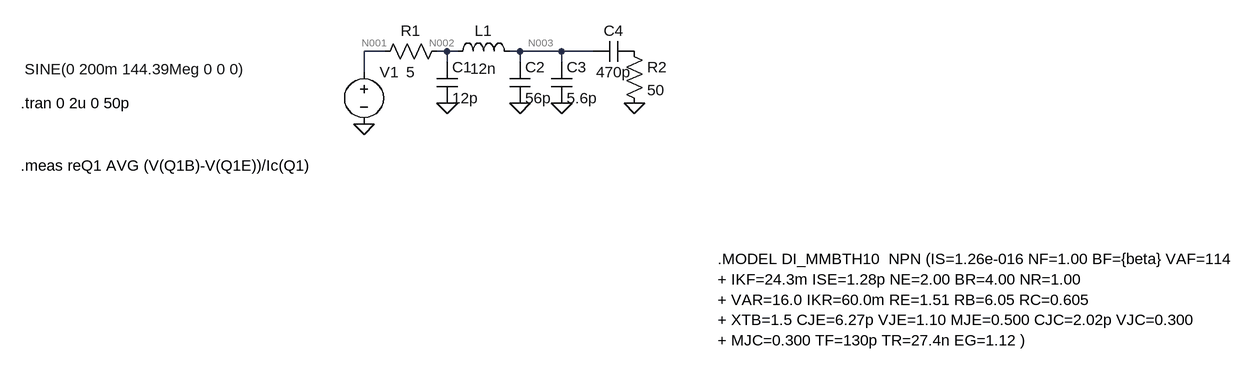
[diagram p0: schematic Draft2.asc]
Draft2.asc, the LTspice schematic file:
Version 4
SHEET 1 1380 680
WIRE -256 96 -288 96
WIRE -160 96 -176 96
WIRE -144 96 -160 96
WIRE -48 96 -64 96
WIRE 16 96 -48 96
WIRE 64 96 16 96
WIRE -160 112 -160 96
WIRE -48 112 -48 96
WIRE 16 112 16 96
WIRE -288 128 -288 96
FLAG -288 208 0
FLAG 16 176 0
FLAG -48 176 0
FLAG -160 176 0
FLAG 128 176 0
SYMBOL voltage -288 112 R0
WINDOW 3 -522 11 Left 2
WINDOW 123 0 0 Left 0
WINDOW 39 0 0 Left 0
SYMATTR Value SINE(0 200m 144.39Meg 0 0 0)
SYMATTR InstName V1
SYMBOL res -160 80 R90
WINDOW 0 0 56 VBottom 2
WINDOW 3 32 56 VTop 2
SYMATTR InstName R1
SYMATTR Value 5
SYMBOL ind -160 112 R270
WINDOW 0 32 56 VTop 2
WINDOW 3 5 56 VBottom 2
SYMATTR InstName L1
SYMATTR Value 12n
SYMBOL cap -176 112 R0
SYMATTR InstName C1
SYMATTR Value 12p
SYMBOL cap -64 112 R0
SYMATTR InstName C2
SYMATTR Value 56p
SYMBOL cap 0 112 R0
SYMATTR InstName C3
SYMATTR Value 5.6p
SYMBOL cap 128 80 R90
WINDOW 0 0 32 VBottom 2
WINDOW 3 32 32 VTop 2
SYMATTR InstName C4
SYMATTR Value 470p
SYMBOL res 112 80 R0
SYMATTR InstName R2
SYMATTR Value 50
TEXT 256 416 Left 2 !.MODEL DI_MMBTH10  NPN (IS=1.26e-016 NF=1.00 BF={beta} VAF=114\n+ IKF=24.3m ISE=1.28p NE=2.00 BR=4.00 NR=1.00\n+ VAR=16.0 IKR=60.0m RE=1.51 RB=6.05 RC=0.605\n+ XTB=1.5 CJE=6.27p VJE=1.10 MJE=0.500 CJC=2.02p VJC=0.300\n+ MJC=0.300 TF=130p TR=27.4n EG=1.12 )
TEXT -816 176 Left 2 !.tran 0 2u 0 50p
TEXT -816 272 Left 2 !.meas reQ1 AVG (V(Q1B)-V(Q1E))/Ic(Q1)

The netlist it stands for:
* Draft2.asc
V1 N001 0 SINE(0 200m 144.39Meg 0 0 0)
R1 N002 N001 5
L1 N002 N003 12n
C1 N002 0 12p
C2 N003 0 56p
C3 N003 0 5.6p
C4 P001 N003 470p
R2 P001 0 50
.MODEL DI_MMBTH10  NPN (IS=1.26e-016 NF=1.00 BF={beta} VAF=114
+ IKF=24.3m ISE=1.28p NE=2.00 BR=4.00 NR=1.00
+ VAR=16.0 IKR=60.0m RE=1.51 RB=6.05 RC=0.605
+ XTB=1.5 CJE=6.27p VJE=1.10 MJE=0.500 CJC=2.02p VJC=0.300
+ MJC=0.300 TF=130p TR=27.4n EG=1.12 )
.tran 0 2u 0 50p
.meas reQ1 AVG (V(Q1B)-V(Q1E))/Ic(Q1)
.backanno
.end

* Results of the author's LTspice run, read from the files saved beside the schematic
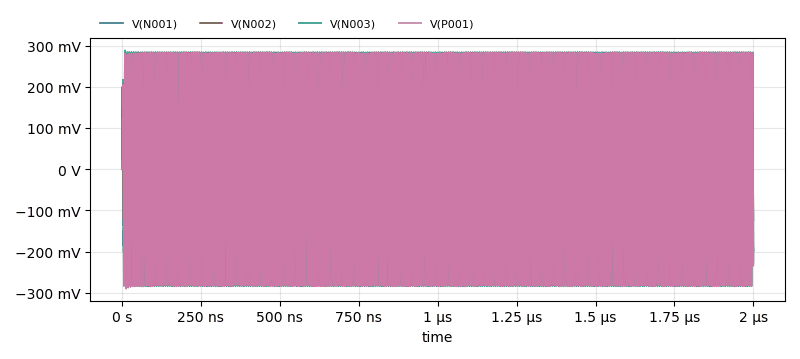
[diagram p1: Transient Analysis of Draft2.asc, plotted from the saved traces]
* Transient Analysis, 1 run:
*   V(N001): min -200 mV, max 200 mV, average 89.58 µV, rms 141.4 mV, last -196.5 mV
*   V(N002): min -125 mV, max 150.9 mV, average 119.2 µV, rms 88.4 mV, last -124 mV
*   V(N003): min -285.7 mV, max 288.4 mV, average 205.1 µV, rms 201.1 mV, last -226.5 mV
*   V(P001): min -290.7 mV, max 284.2 mV, average 88.85 µV, rms 200.8 mV, last -234.1 mV
* From the log:
*   Measurement "req1" FAIL'ed